# Altium schematic sheet LCDTFT_BLOCKS.SchDoc: =DocumentName
size A2; DocumentNumber: 11; SheetNumber: 11; SheetTotal: 19
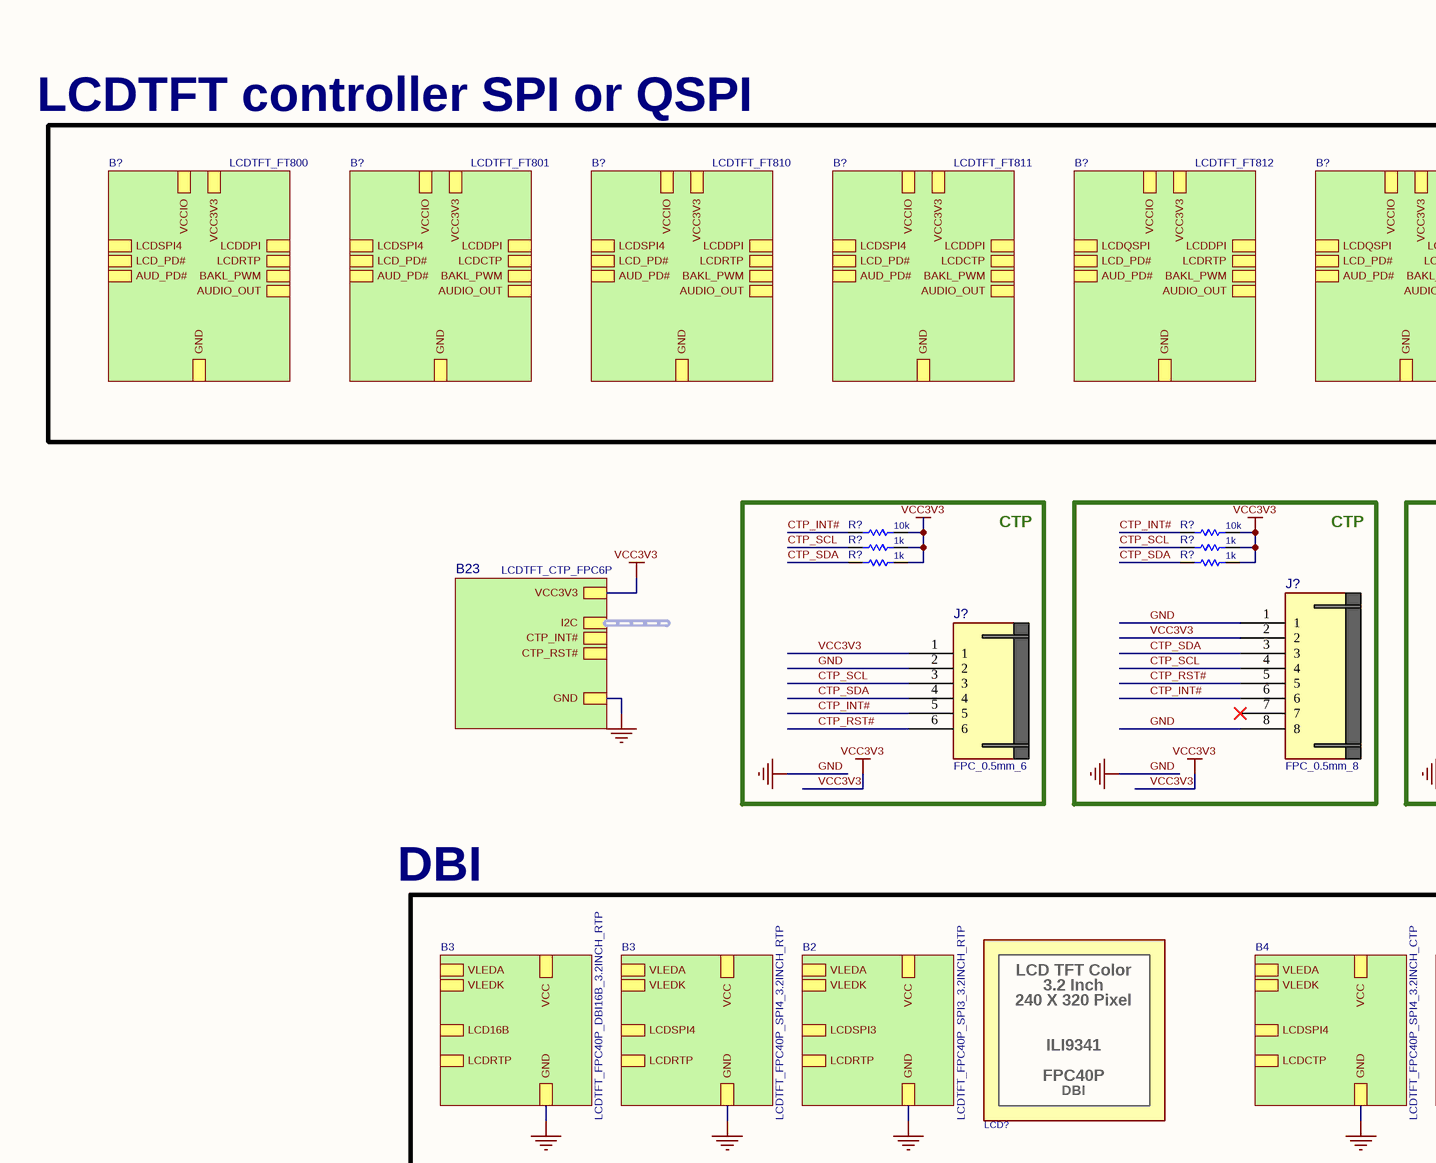
[diagram p0: LCDTFT_BLOCKS.SchDoc, top left]
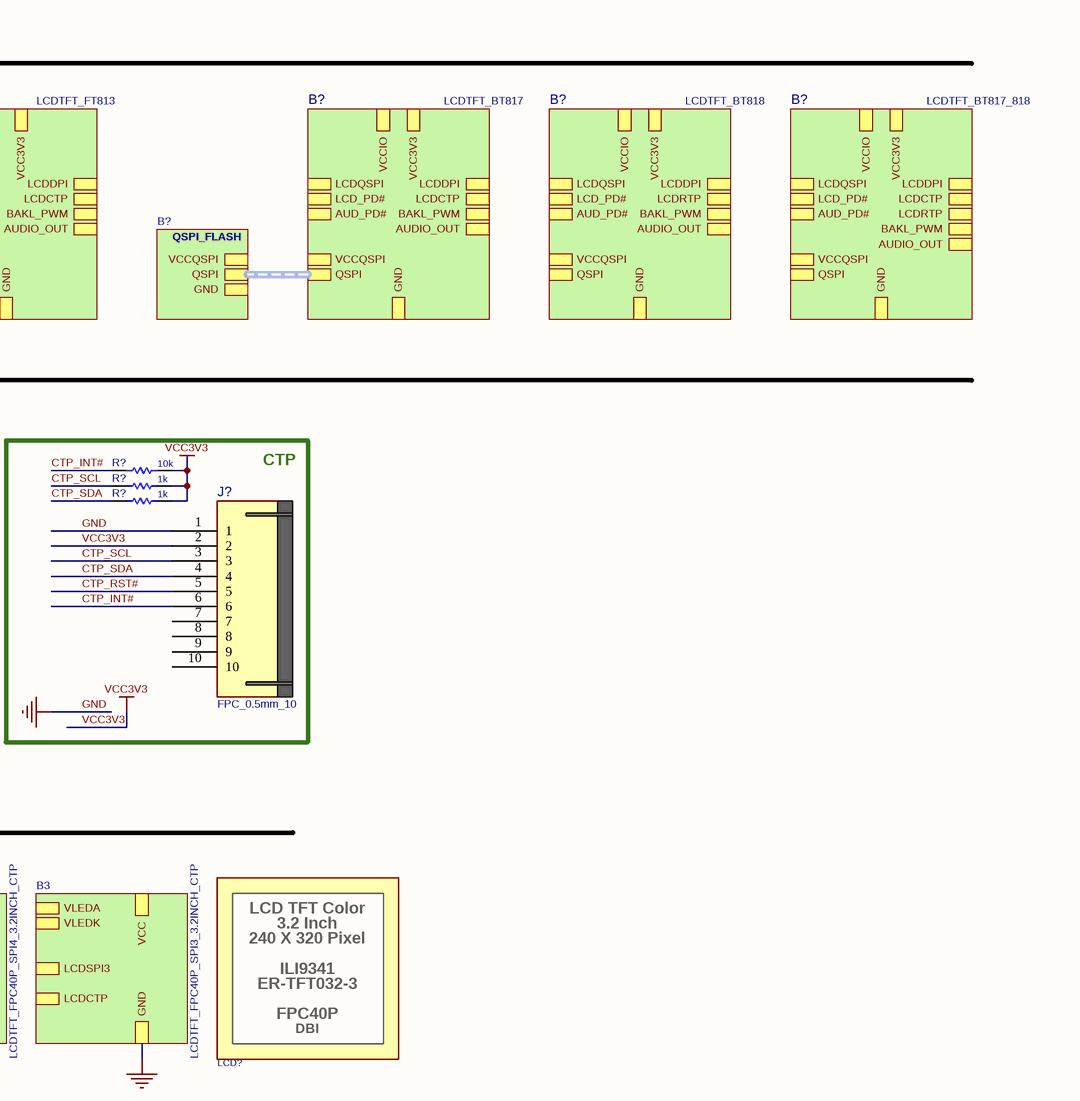
[diagram p1: LCDTFT_BLOCKS.SchDoc, top right]
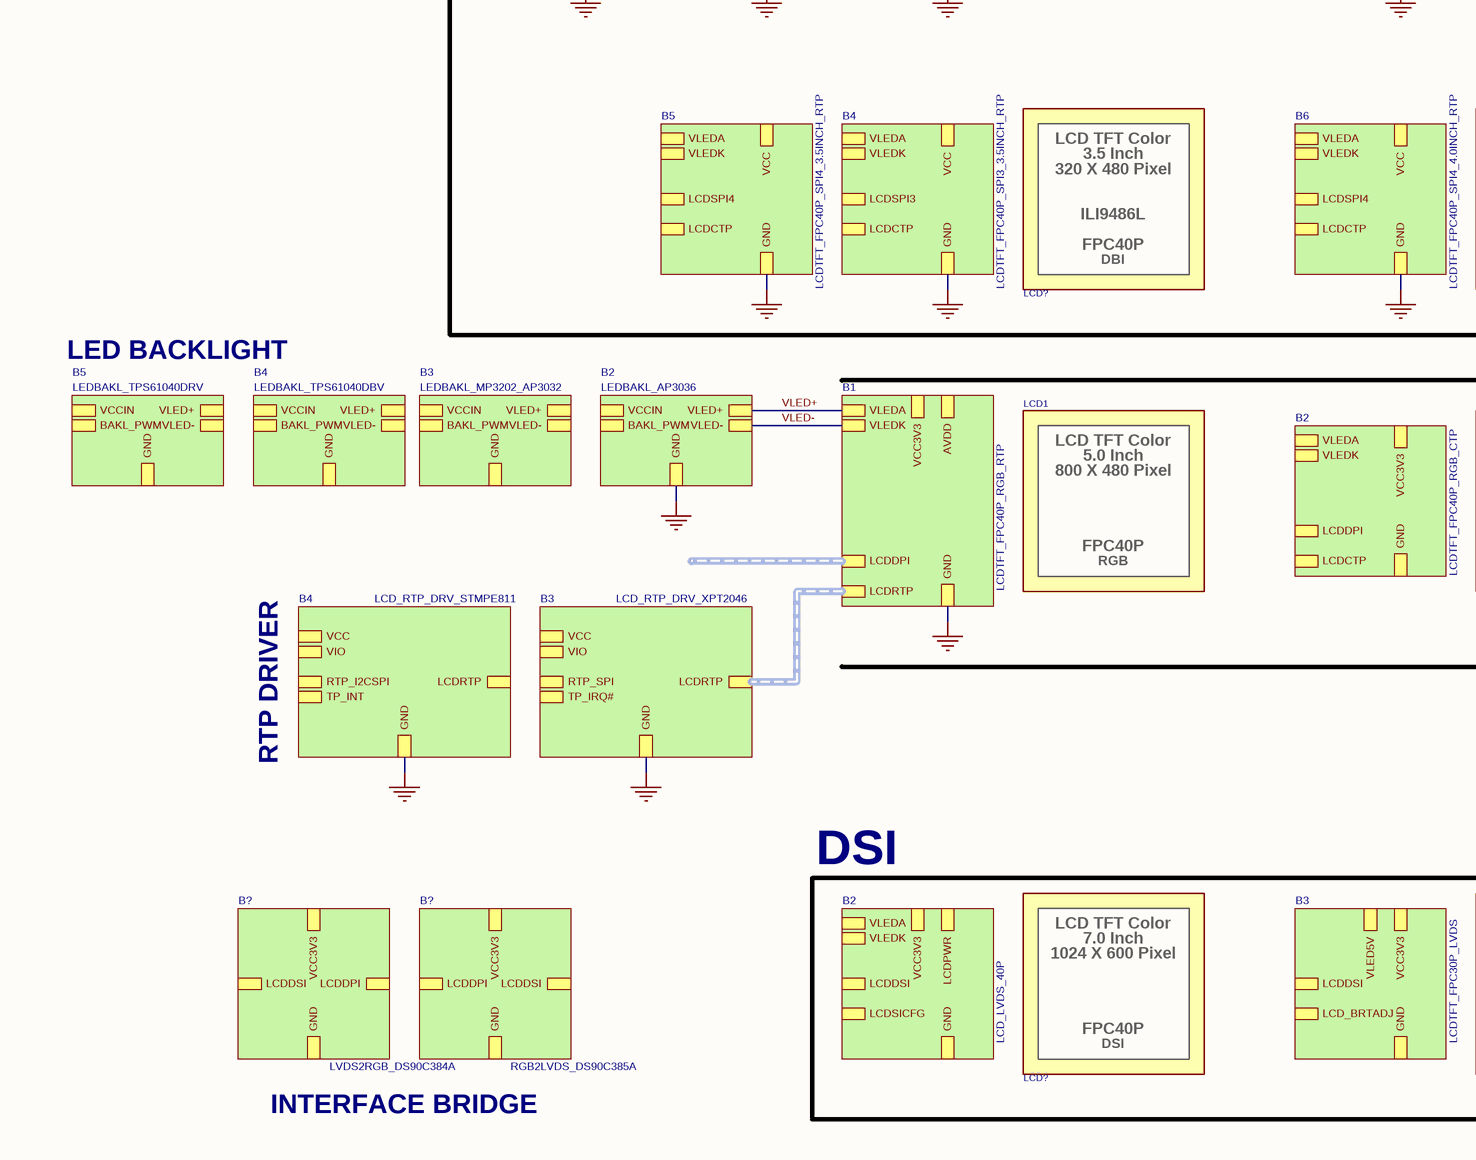
[diagram p2: LCDTFT_BLOCKS.SchDoc, bottom left]
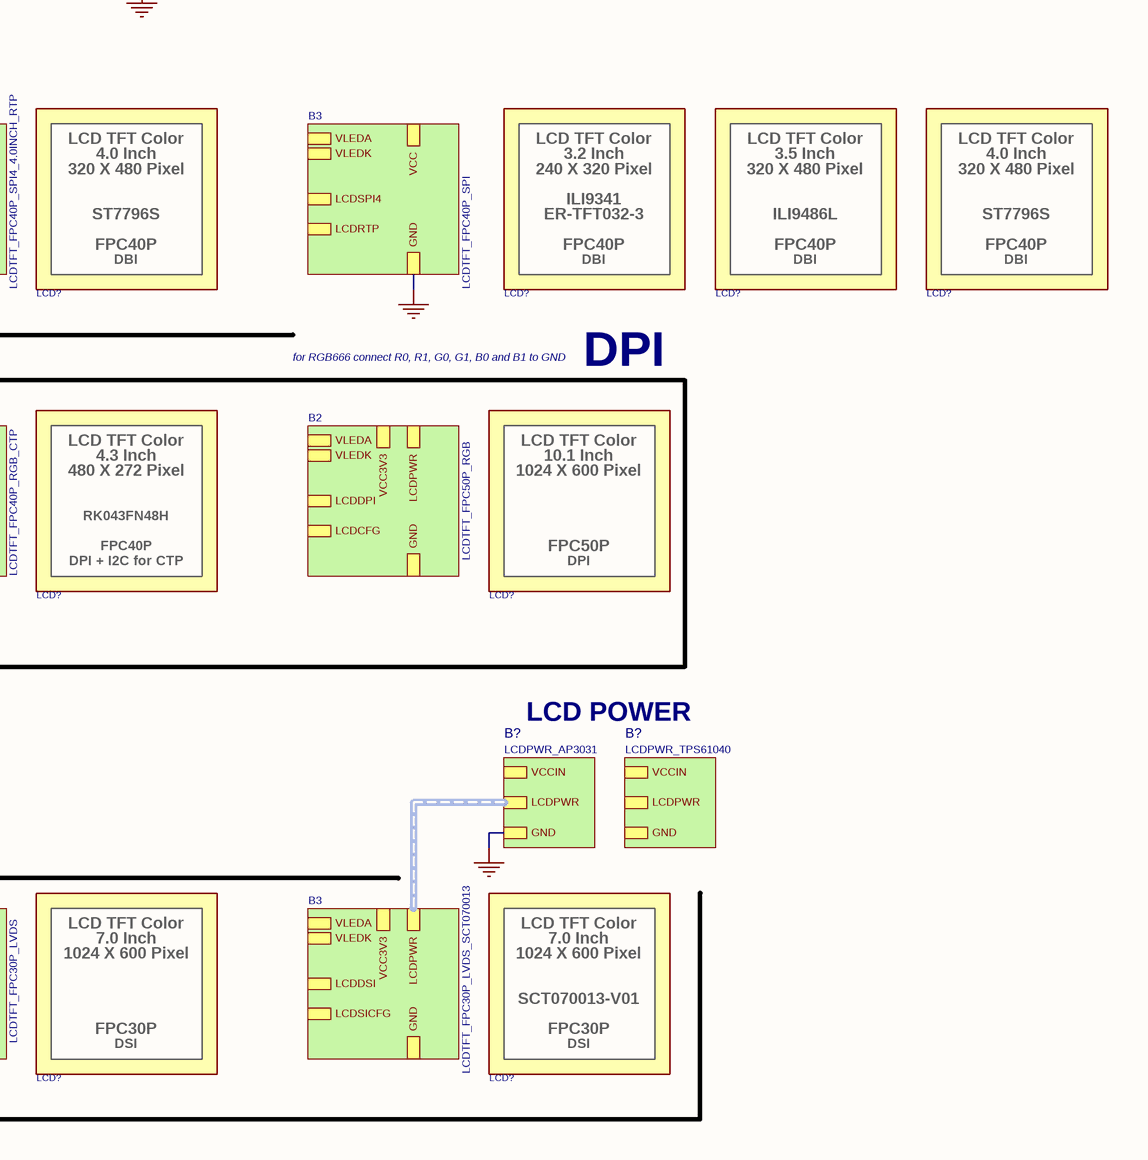
[diagram p3: LCDTFT_BLOCKS.SchDoc, bottom right]

## Parts
(Parts that share a designator on the sheet are numbered #1, #2 ... from top to bottom, then left to right.)
J?#1  FPC_0.5mm_10  [FPC50_10]
J?#2  FPC_0.5mm_6  [FPC50_6]
J?#3  FPC_0.5mm_8  [FPC50_8_SFV8R]
LCD1  LCDTFT_5INCH  [LCDTFT5_FPC40P]  (value not drawn)  (mechanical)
LCD?#1  LCDTFT_3.2INCH  [LCDTFT3P2_FPC40P]  (value not drawn)  (mechanical)
LCD?#2  LCDTFT_3.2INCH  [LCDTFT3P2_FPC40P]  (value not drawn)  (mechanical)
LCD?#3  LCDTFT_3.5INCH  [LCDTFT3P5_FPC40P]  (value not drawn)  (mechanical)
LCD?#4  LCDTFT_4INCH  [LCDTFT4_FPC40P]  (value not drawn)  (mechanical)
LCD?#5  LCDTFT_3.2INCH  [LCDTFT3P2_FPC40P]  (value not drawn)  (mechanical)
LCD?#6  LCDTFT_3.5INCH  [LCDTFT3P5_FPC40P]  (value not drawn)  (mechanical)
LCD?#7  LCDTFT_4INCH  [LCDTFT4_FPC40P]  (value not drawn)  (mechanical)
LCD?#8  LCDTFT_4.3INCH  [LCDTFT4P3_FPC40P]  (value not drawn)  (mechanical)
LCD?#9  LCDTFT_9INCH  [LCDTFT10P1_FPC50P]  (value not drawn)  (mechanical)
LCD?#10  LCDTFT_7INCH  [LCDTFT7_FPC40P]  (value not drawn)  (mechanical)
LCD?#11  LCDTFT_7INCH  [LCDTFT7_FPC40P]  (value not drawn)  (mechanical)
LCD?#12  LCDTFT_7INCH  [LCDTFT7_FPC40P]  (value not drawn)  (mechanical)
R?#1  10k  [R0402]
R?#2  10k  [R0402]
R?#3  10k  [R0402]
R?#4  1k  [R0402]
R?#5  1k  [R0402]
R?#6  1k  [R0402]
R?#7  1k  [R0402]
R?#8  1k  [R0402]
R?#9  1k  [R0402]

## Blocks framed on the sheet
CTP: J?#2 R?#1 R?#4 R?#7
CTP: J?#3 R?#2 R?#5 R?#8
CTP: J?#1 R?#3 R?#6 R?#9

## Sub-sheets
B1 = LCDTFT_FPC40P_RGB_RTP: LCDDPI (harness LCDRGB666), GND, VCC3V3, VLEDA, VLEDK, LCDRTP (harness LCDRTP), AVDD
B2 = LEDBAKL_AP3036: GND, VCCIN, VLED+, VLED-, BAKL_PWM
B2 = LCDTFT_FPC40P_RGB_CTP: LCDDPI (harness LCDRGB666), GND, VCC3V3, VLEDA, VLEDK, LCDCTP (harness LCDRTP)
B2 = LCDTFT_FPC50P_RGB: LCDDPI (harness LCDRGB666), GND, VCC3V3, VLEDA, VLEDK, LCDCFG (harness LCDRTP), LCDPWR (harness LCDRGB666)
B2 = LCDTFT_FPC40P_SPI3_3.2INCH_RTP: LCDSPI3 (harness LCDRGB666), GND, VCC, VLEDA, VLEDK, LCDRTP (harness LCDRTP)
B2 = LCD_LVDS_40P: LCDDSI (harness LCDRGB666), GND, VCC3V3, VLEDA, VLEDK, LCDSICFG (harness LCDRTP), LCDPWR (harness LCDRGB666)
B3 = LCD_RTP_DRV_XPT2046: LCDRTP (harness LCDRTP), GND, VCC, VIO, RTP_SPI (harness RTP_SPI), TP_IRQ#
B3 = LCDTFT_FPC40P_SPI3_3.2INCH_CTP: LCDSPI3 (harness LCDRGB666), GND, VCC, VLEDA, VLEDK, LCDCTP (harness LCDRTP)
B3 = LCDTFT_FPC40P_SPI4_3.2INCH_RTP: LCDSPI4 (harness LCDRGB666), GND, VCC, VLEDA, VLEDK, LCDRTP (harness LCDRTP)
B3 = LCDTFT_FPC30P_LVDS: LCDDSI (harness LCDRGB666), GND, VCC3V3, VLED5V, LCD_BRTADJ
B3 = LCDTFT_FPC30P_LVDS_SCT070013: LCDDSI (harness LCDRGB666), GND, VCC3V3, VLEDA, VLEDK, LCDSICFG (harness LCDRTP), LCDPWR (harness LCDRGB666)
B3 = LCDTFT_FPC40P_DBI16B_3.2INCH_RTP: LCD16B (harness LCDRGB666), GND, VCC, VLEDA, VLEDK, LCDRTP (harness LCDRTP)
B3 = LEDBAKL_MP3202_AP3032: GND, VCCIN, VLED+, VLED-, BAKL_PWM
B3 = LCDTFT_FPC40P_SPI: LCDSPI4 (harness LCDRGB666), GND, VCC, VLEDA, VLEDK, LCDRTP (harness LCDRTP)
B4 = LCD_RTP_DRV_STMPE811: LCDRTP (harness LCDRTP), GND, VCC, VIO, RTP_I2CSPI (harness RTP_SPI), TP_INT
B4 = LCDTFT_FPC40P_SPI4_3.2INCH_CTP: LCDSPI4 (harness LCDRGB666), GND, VCC, VLEDA, VLEDK, LCDCTP (harness LCDRTP)
B4 = LCDTFT_FPC40P_SPI3_3.5INCH_RTP: LCDSPI3 (harness LCDRGB666), GND, VCC, VLEDA, VLEDK, LCDCTP (harness LCDRTP)
B4 = LEDBAKL_TPS61040DBV: GND, VCCIN, VLED+, VLED-, BAKL_PWM
B5 = LCDTFT_FPC40P_SPI4_3.5INCH_RTP: LCDSPI4 (harness LCDRGB666), GND, VCC, VLEDA, VLEDK, LCDCTP (harness LCDRTP)
B5 = LEDBAKL_TPS61040DRV: GND, VCCIN, VLED+, VLED-, BAKL_PWM
B6 = LCDTFT_FPC40P_SPI4_4.0INCH_RTP: LCDSPI4 (harness LCDRGB666), GND, VCC, VLEDA, VLEDK, LCDCTP (harness LCDRTP)
B23 = LCDTFT_CTP_FPC6P: CTP_RST#, CTP_INT#, VCC3V3, GND, I2C (harness I2C)
B? = LCDPWR_AP3031: LCDPWR (harness LCDPWR), VCCIN, GND
B? = LCDPWR_TPS61040: LCDPWR (harness LCDPWR), VCCIN, GND
B? = RGB2LVDS_DS90C385A: VCC3V3, GND, LCDDPI (harness LCDDPI), LCDDSI (harness LCDDSI)
B? = LVDS2RGB_DS90C384A: VCC3V3, GND, LCDDPI (harness LCDDPI), LCDDSI (harness LCDDSI)
B? = LCDTFT_BT817: LCDDPI (harness LCDDPI), BAKL_PWM, AUDIO_OUT, LCDQSPI (harness LCDQSPI), LCD_PD#, AUD_PD#, VCC3V3, VCCIO, GND, QSPI (harness QSPI), VCCQSPI, LCDCTP (harness LCDCTP)
B? = LCDTFT_BT818: LCDDPI (harness LCDDPI), BAKL_PWM, AUDIO_OUT, LCDQSPI (harness LCDQSPI), LCD_PD#, AUD_PD#, VCC3V3, VCCIO, GND, QSPI (harness QSPI), VCCQSPI, LCDRTP (harness LCDCTP)
B? = LCDTFT_BT817_818: LCDDPI (harness LCDDPI), BAKL_PWM, AUDIO_OUT, LCDQSPI (harness LCDQSPI), LCD_PD#, AUD_PD#, VCC3V3, VCCIO, GND, QSPI (harness QSPI), VCCQSPI, LCDCTP (harness LCDCTP), LCDRTP (harness LCDCTP)
B? = LCDTFT_FT800: LCDDPI (harness LCDDPI), BAKL_PWM, LCDRTP (harness LCDRTP), AUDIO_OUT, LCDSPI4 (harness LCDSPI4), LCD_PD#, AUD_PD#, VCC3V3, VCCIO, GND
B? = LCDTFT_FT801: LCDDPI (harness LCDDPI), BAKL_PWM, LCDCTP (harness LCDRTP), AUDIO_OUT, LCDSPI4 (harness LCDSPI4), LCD_PD#, AUD_PD#, VCC3V3, VCCIO, GND
B? = LCDTFT_FT810: LCDDPI (harness LCDDPI), BAKL_PWM, LCDRTP (harness LCDRTP), AUDIO_OUT, LCDSPI4 (harness LCDSPI4), LCD_PD#, AUD_PD#, VCC3V3, VCCIO, GND
B? = LCDTFT_FT811: LCDDPI (harness LCDDPI), BAKL_PWM, LCDCTP (harness LCDRTP), AUDIO_OUT, LCDSPI4 (harness LCDSPI4), LCD_PD#, AUD_PD#, VCC3V3, VCCIO, GND
B? = LCDTFT_FT812: LCDDPI (harness LCDDPI), BAKL_PWM, LCDRTP (harness LCDRTP), AUDIO_OUT, LCDQSPI (harness LCDQSPI), LCD_PD#, AUD_PD#, VCC3V3, VCCIO, GND
B? = LCDTFT_FT813: LCDDPI (harness LCDDPI), BAKL_PWM, LCDCTP (harness LCDRTP), AUDIO_OUT, LCDQSPI (harness LCDQSPI), LCD_PD#, AUD_PD#, VCC3V3, VCCIO, GND
B? = QSPI_FLASH: QSPI (harness QSPI), VCCQSPI, GND

## Nets
GND: J?#1.1 J?#2.2 J?#3.1 J?#3.8 ; sheet B1/GND, sheet B2/GND, sheet B3/GND, sheet B4/GND, sheet B2/GND, sheet B3/GND, sheet B3/GND, sheet B4/GND, sheet B4/GND, sheet B5/GND, sheet B6/GND, sheet B3/GND, sheet B?/GND, sheet B3/GND, sheet B23/GND
VCC3V3: J?#1.2 J?#2.1 J?#3.2 R?#1.2 R?#2.2 R?#3.2 R?#4.2 R?#5.2 R?#6.2 R?#7.2 R?#8.2 R?#9.2 ; sheet B23/VCC3V3
CTP_INT#: J?#1.6 J?#2.5 J?#3.6 R?#1.1 R?#2.1 R?#3.1
CTP_RST#: J?#1.5 J?#2.6 J?#3.5
CTP_SCL: J?#1.3 J?#2.3 J?#3.4 R?#4.1 R?#5.1 R?#6.1
CTP_SDA: J?#1.4 J?#2.4 J?#3.3 R?#7.1 R?#8.1 R?#9.1
VLED+: sheet B1/VLEDA, sheet B2/VLED+
VLED-: sheet B1/VLEDK, sheet B2/VLED-

Not connected (* = marked no-connect by the designer): J?#1 7 8 9 10; J?#3 7*

## Buses and harness runs
harness sheet B1/LCDRTP = sheet B3/LCDRTP
harness sheet B3/LCDPWR = sheet B?/LCDPWR

## Notes on the sheet
- LCDTFT controller SPI or QSPI
- DBI
- LED BACKLIGHT
- for RGB666 connect R0, R1, G0, G1, B0 and B1 to GND
- DPI
- RTP DRIVER
- LCD POWER
- DSI
- INTERFACE BRIDGE
- Title:
- Project:
- Sheet:
- Revision:
- of
- Engineer:
- Approved By:
- File:
- (in symbol LCDTFT_3.2INCH_240X320_ER-TFT032-3) LCD TFT Color; 3.2 Inch; 240 X 320 Pixel; ILI9341; ER-TFT032-3; FPC40P; DBI
- (in symbol LCDTFT_3.2INCH_240X320_ILI9341) LCD TFT Color; 3.2 Inch; 240 X 320 Pixel; ILI9341; FPC40P; DBI
- (in symbol LCDTFT_3.5INCH_320X480_ILI9486L_40P) LCD TFT Color; 3.5 Inch; 320 X 480 Pixel; ILI9486L; FPC40P; DBI
- (in symbol LCDTFT_4.0INCH_320X480_ST7796S) LCD TFT Color; 4.0 Inch; 320 X 480 Pixel; ST7796S; FPC40P; DBI
- (in symbol LCDTFT_4.3INCH_480X272_RK043FN48H) LCD TFT Color; 4.3 Inch; 480 X 272 Pixel; RK043FN48H; FPC40P; DPI + I2C for CTP
- (in symbol LCDTFT_5.0INCH_800X480) LCD TFT Color; 5.0 Inch; 800 X 480 Pixel; FPC40P; RGB
- (in symbol LCDTFT_7INCH_1024X600_FPC30P) LCD TFT Color; 7.0 Inch; 1024 X 600 Pixel; FPC30P; DSI
- (in symbol LCDTFT_7INCH_1024X600_FPC30P_SCT070013) LCD TFT Color; 7.0 Inch; 1024 X 600 Pixel; FPC30P; DSI
- (in symbol LCDTFT_7INCH_1024X600_FPC40P) LCD TFT Color; 7.0 Inch; 1024 X 600 Pixel; FPC40P; DSI
- (in symbol LCDTFT_10.1INCH_1024X600) LCD TFT Color; 10.1 Inch; 1024 X 600 Pixel; FPC50P; DPI

## Library data of the parts
J?#1 = FPC50_10: CONN, FPC, 0.50mm pitch, RightAngle, Bot. Contact, Hinge type; DESC: LCD Touch; MANF: Wurth Elektronik; MANF_P#: 687110149022; VALUE: FPC_0.5mm_10
J?#2 = FPC50_6: CONN, FPC, 0.50mm pitch, RightAngle, Bot. Contact, Hinge type; MANF: FCI; MANF_P#: SFV6R1STBE1HLF; VALUE: FPC_0.5mm_6
J?#3 = FPC50_8_SFV8R: CONN, FPC, 0.50mm pitch, RightAngle, Top. Contact, Slide type; DESC: LCD Touch; MANF: Amphenol/FCI; MANF_P#: SFV8R-2STE1HLF; PARAM: -55~105oC; PRICE: 0.3$; VALUE: FPC_0.5mm_8
LCD1 = LCDTFT_5.0INCH_800X480: LCD TFT Color, 5", 800X480 with touch; MANF: -; MANF_P#: LCDTFT_5INCH; VALUE: LCDTFT_5INCH
LCD?#1 = LCDTFT_3.2INCH_240X320_ILI9341: LCD TFT Color, 3.2", 240X320 with touch; MANF: -; MANF_P#: LCDTFT_3.2INCH; VALUE: LCDTFT_3.2INCH
LCD?#2 LCD?#5 = LCDTFT_3.2INCH_240X320_ER-TFT032-3: LCD TFT Color, 3.2", 240X320 with touch; MANF: -; MANF_P#: LCDTFT_3.2INCH; VALUE: LCDTFT_3.2INCH
LCD?#3 LCD?#6 = LCDTFT_3.5INCH_320X480_ILI9486L_40P: LCD TFT Color, 3.5", 320X480 with touch; MANF: -; MANF_P#: LCDTFT_3.5INCH; VALUE: LCDTFT_3.5INCH
LCD?#4 LCD?#7 = LCDTFT_4.0INCH_320X480_ST7796S: LCD TFT Color, 4", 320X480 with touch; MANF: -; MANF_P#: LCDTFT_4INCH; VALUE: LCDTFT_4INCH
LCD?#8 = LCDTFT_4.3INCH_480X272_RK043FN48H: LCD TFT Color, 4", 480X272 with capacitive touch GT9147; MANF_P#: RK043FN48H-CT672B; MANF: -; VALUE: LCDTFT_4.3INCH
LCD?#9 = LCDTFT_10.1INCH_1024X600: LCD TFT Color, 10.1", 1024X600; MANF_P#: -; PARAM: Color, 10.1", 1024X600; VALUE: LCDTFT_9INCH
LCD?#10 = LCDTFT_7INCH_1024X600_FPC40P: LCD TFT Color, 7", 1024X600, LVDS; MANF_P#: DT070DTFT, EA R1024X-70A, RVT70HSLFWCA0, RVT70HSLNWCA0; MANF: -; PARAM: Color, 7", 1024X600; VALUE: LCDTFT_7INCH
LCD?#11 = LCDTFT_7INCH_1024X600_FPC30P: LCD TFT Color, 7", 1024X600, LVDS; MANF_P#: 070XIEB0GH1, 070XIEBCBH6; MANF: -; PARAM: Color, 7", 1024X600; VALUE: LCDTFT_7INCH
LCD?#12 = LCDTFT_7INCH_1024X600_FPC30P_SCT070013: LCD TFT Color, 7", 1024X600, LVDS; MANF_P#: SCT070013-V01; MANF: -; PARAM: Color, 7", 1024X600; VALUE: LCDTFT_7INCH
R?#1-R?#9 = RES_SMD: RESISTOR, SMD; PARAM: 0.063W; DESC: DESCRIPTION; DIST#: MOUSER; PARAM2: 1%; MANF_P#: -; MANF: -; ASSEMBLY: ASSEMBLY; PRICE: 100= 0.3$
  R?#1-R?#3: VALUE: 10k
  R?#4-R?#9: VALUE: 1k